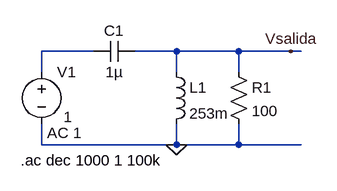
[diagram p0: schematic Punto 3.asc]
Punto 3.asc, the LTspice schematic file:
Version 4
SHEET 1 880 680
WIRE 64 96 -16 96
WIRE 192 96 128 96
WIRE 288 96 192 96
WIRE 368 96 288 96
WIRE 384 96 368 96
WIRE -16 128 -16 96
WIRE 192 128 192 96
WIRE 288 128 288 96
WIRE -16 240 -16 208
WIRE 192 240 192 208
WIRE 192 240 -16 240
WIRE 288 240 288 208
WIRE 288 240 192 240
WIRE 384 240 288 240
FLAG 192 240 0
FLAG 368 96 Vsalida
SYMBOL voltage -16 112 R0
WINDOW 3 34 85 Left 2
WINDOW 123 9 110 Left 2
WINDOW 39 0 0 Left 0
SYMATTR Value 1
SYMATTR Value2 AC 1
SYMATTR InstName V1
SYMBOL ind 176 112 R0
SYMATTR InstName L1
SYMATTR Value 253m
SYMBOL cap 128 80 R90
WINDOW 0 0 32 VBottom 2
WINDOW 3 32 32 VTop 2
SYMATTR InstName C1
SYMATTR Value 1µ
SYMBOL res 272 112 R0
SYMATTR InstName R1
SYMATTR Value 100
TEXT -48 264 Left 2 !.ac dec 1000 1 100k

The netlist it stands for:
* Punto 3.asc
V1 N001 0 1 AC 1
L1 Vsalida 0 253m
C1 Vsalida N001 1µ
R1 Vsalida 0 100
.ac dec 1000 1 100k
.backanno
.end

* Results of the author's LTspice run, read from the files saved beside the schematic
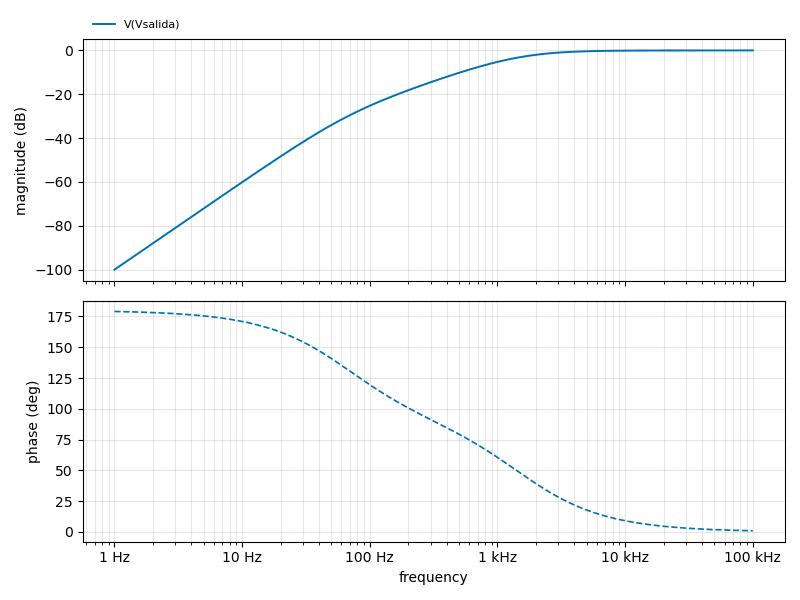
[diagram p1: AC Analysis of Punto 3.asc, plotted from the saved traces]
* AC Analysis, 1 run:
*   V(Vsalida): -100.01 dB at 1 Hz, -0.00 dB at 100 kHz, peak -0.00 dB at 100 kHz, 3 dB below the peak at 1.528 kHz